# Altium schematic sheet DDR3L Memory.SchDoc
size A4
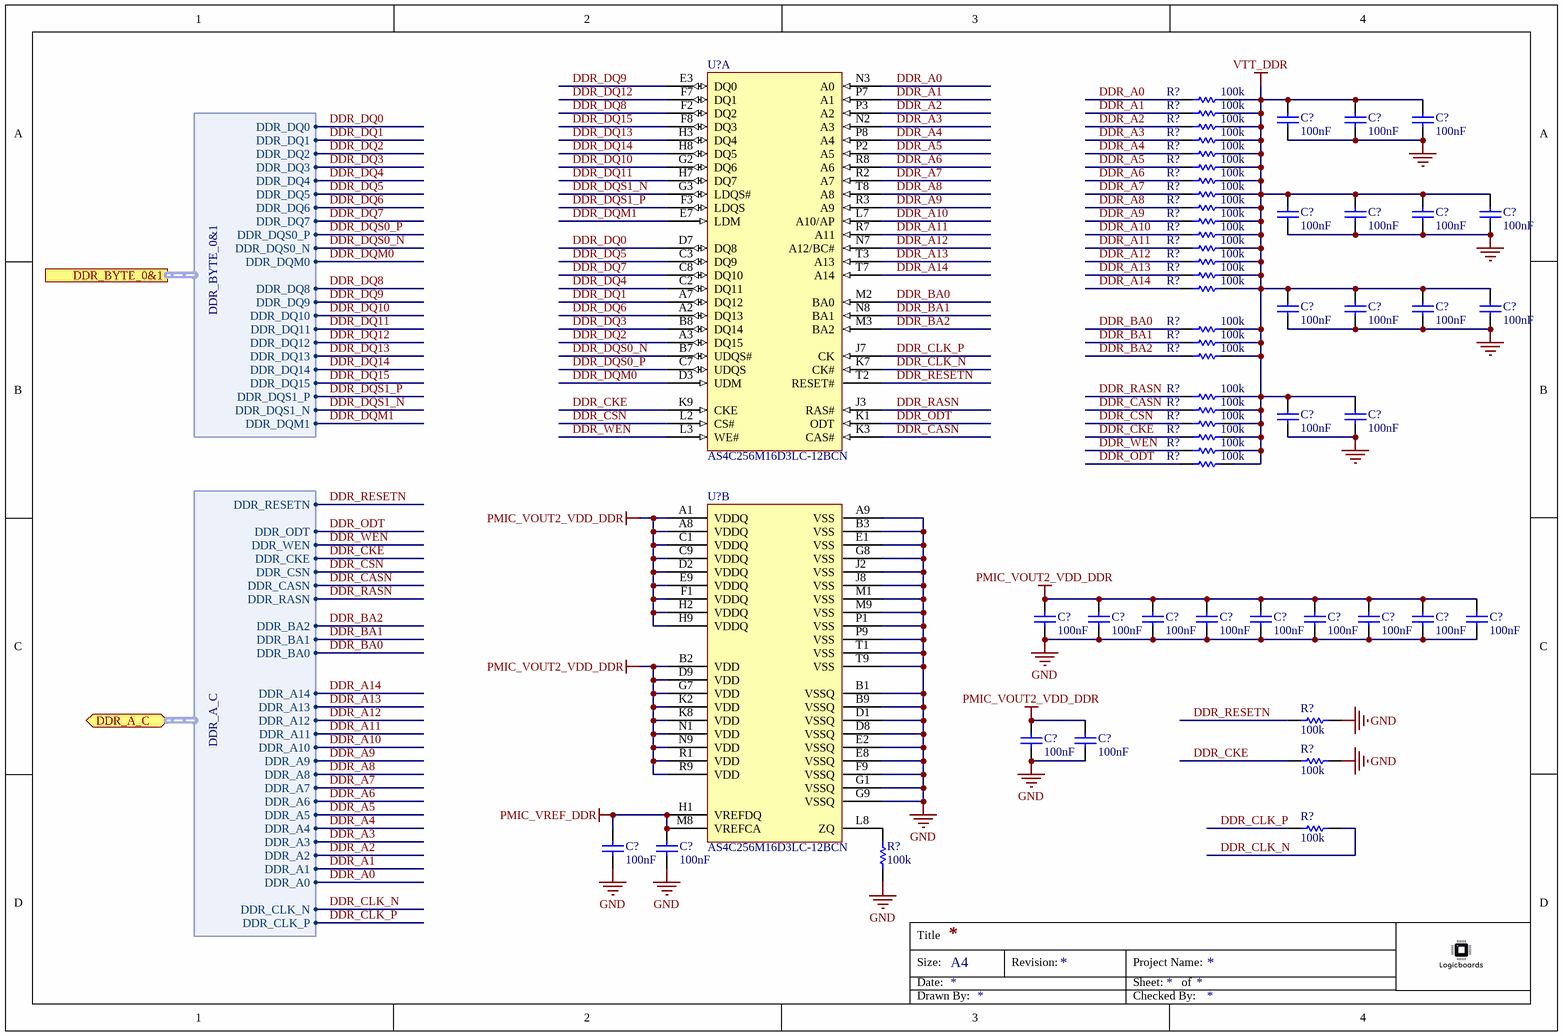
[diagram p0: DDR3L Memory.SchDoc]

## Parts
(Parts that share a designator on the sheet are numbered #1, #2 ... from top to bottom, then left to right.)
C?#1  100nF
C?#2  100nF
C?#3  100nF
C?#4  100nF
C?#5  100nF
C?#6  100nF
C?#7  100nF
C?#8  100nF
C?#9  100nF
C?#10  100nF
C?#11  100nF
C?#12  100nF
C?#13  100nF
C?#14  100nF
C?#15  100nF
C?#16  100nF
C?#17  100nF
C?#18  100nF
C?#19  100nF
C?#20  100nF
C?#21  100nF
C?#22  100nF
C?#23  100nF
C?#24  100nF
C?#25  100nF
C?#26  100nF
R?#1  100k
R?#2  100k
R?#3  100k
R?#4  100k
R?#5  100k
R?#6  100k
R?#7  100k
R?#8  100k
R?#9  100k
R?#10  100k
R?#11  100k
R?#12  100k
R?#13  100k
R?#14  100k
R?#15  100k
R?#16  100k
R?#17  100k
R?#18  100k
R?#19  100k
R?#20  100k
R?#21  100k
R?#22  100k
R?#23  100k
R?#24  100k
R?#25  100k
R?#26  100k
R?#27  100k
R?#28  100k
U?#1  AS4C256M16D3LC-12BCN  (part A of 2)
U?#2  AS4C256M16D3LC-12BCN  (part B of 2)

## Ports
DDR_A_C (bidir, harness DDR_A_C), DDR_BYTE_0&1 (harness DDR_BYTE_0&1)

## Harnesses
DDR_BYTE_0&1: DDR_DQ0, DDR_DQ1, DDR_DQ2, DDR_DQ3, DDR_DQ4, DDR_DQ5, DDR_DQ6, DDR_DQ7, DDR_DQS0_P, DDR_DQS0_N, DDR_DQM0, DDR_DQ8, DDR_DQ9, DDR_DQ10, DDR_DQ11, DDR_DQ12, DDR_DQ13, DDR_DQ14, DDR_DQ15, DDR_DQS1_P, DDR_DQS1_N, DDR_DQM1
DDR_A_C: DDR_CLK_P, DDR_CLK_N, DDR_A0, DDR_A1, DDR_A2, DDR_A3, DDR_A4, DDR_A5, DDR_A6, DDR_A7, DDR_A8, DDR_A9, DDR_A10, DDR_A11, DDR_A12, DDR_A13, DDR_A14, DDR_BA0, DDR_BA1, DDR_BA2, DDR_RASN, DDR_CASN, DDR_CSN, DDR_CKE, DDR_WEN, DDR_ODT, DDR_RESETN

## Nets
GND: C?#1.2 C?#2.2 C?#3.2 C?#4.2 C?#5.2 C?#6.2 C?#7.2 C?#8.2 C?#9.2 C?#10.2 C?#11.2 C?#12.2 C?#13.2 C?#14.2 C?#15.2 C?#16.2 C?#17.2 C?#18.2 C?#19.2 C?#20.2 C?#21.2 C?#22.2 C?#23.2 C?#24.2 C?#25.2 C?#26.2 R?#25.2 R?#26.2 R?#28.1 U?#2.A9(VSS) U?#2.B1(VSSQ) U?#2.B3(VSS) U?#2.B9(VSSQ) U?#2.D1(VSSQ) U?#2.D8(VSSQ) U?#2.E1(VSS) U?#2.E2(VSSQ) U?#2.E8(VSSQ) U?#2.F9(VSSQ) U?#2.G1(VSSQ) U?#2.G8(VSS) U?#2.G9(VSSQ) U?#2.J2(VSS) U?#2.J8(VSS) U?#2.M1(VSS) U?#2.M9(VSS) U?#2.P1(VSS) U?#2.P9(VSS) U?#2.T1(VSS) U?#2.T9(VSS)
PMIC_VOUT2_VDD_DDR: C?#14.1 C?#15.1 C?#16.1 C?#17.1 C?#18.1 C?#19.1 C?#20.1 C?#21.1 C?#22.1 C?#23.1 C?#24.1 U?#2.A1(VDDQ) U?#2.A8(VDDQ) U?#2.B2(VDD) U?#2.C1(VDDQ) U?#2.C9(VDDQ) U?#2.D2(VDDQ) U?#2.D9(VDD) U?#2.E9(VDDQ) U?#2.F1(VDDQ) U?#2.G7(VDD) U?#2.H2(VDDQ) U?#2.H9(VDDQ) U?#2.K2(VDD) U?#2.K8(VDD) U?#2.N1(VDD) U?#2.N9(VDD) U?#2.R1(VDD) U?#2.R9(VDD)
PMIC_VREF_DDR: C?#25.1 C?#26.1 U?#2.H1(VREFDQ) U?#2.M8(VREFCA)
VTT_DDR: C?#1.1 C?#2.1 C?#3.1 C?#4.1 C?#5.1 C?#6.1 C?#7.1 C?#8.1 C?#9.1 C?#10.1 C?#11.1 C?#12.1 C?#13.1 R?#1.2 R?#2.2 R?#3.2 R?#4.2 R?#5.2 R?#6.2 R?#7.2 R?#8.2 R?#9.2 R?#10.2 R?#11.2 R?#12.2 R?#13.2 R?#14.2 R?#15.2 R?#16.2 R?#17.2 R?#18.2 R?#19.2 R?#20.2 R?#21.2 R?#22.2 R?#23.2 R?#24.2
DDR_A0: R?#1.1 U?#1.N3(A0) ; port DDR_A_C.DDR_A0
DDR_A1: R?#2.1 U?#1.P7(A1) ; port DDR_A_C.DDR_A1
DDR_A2: R?#3.1 U?#1.P3(A2) ; port DDR_A_C.DDR_A2
DDR_A3: R?#4.1 U?#1.N2(A3) ; port DDR_A_C.DDR_A3
DDR_A4: R?#5.1 U?#1.P8(A4) ; port DDR_A_C.DDR_A4
DDR_A5: R?#6.1 U?#1.P2(A5) ; port DDR_A_C.DDR_A5
DDR_A6: R?#7.1 U?#1.R8(A6) ; port DDR_A_C.DDR_A6
DDR_A7: R?#8.1 U?#1.R2(A7) ; port DDR_A_C.DDR_A7
DDR_A8: R?#9.1 U?#1.T8(A8) ; port DDR_A_C.DDR_A8
DDR_A9: R?#10.1 U?#1.R3(A9) ; port DDR_A_C.DDR_A9
DDR_A10: R?#11.1 U?#1.L7(A10/AP) ; port DDR_A_C.DDR_A10
DDR_A11: R?#12.1 U?#1.R7(A11) ; port DDR_A_C.DDR_A11
DDR_A12: R?#13.1 U?#1.N7(A12/BC#) ; port DDR_A_C.DDR_A12
DDR_A13: R?#14.1 U?#1.T3(A13) ; port DDR_A_C.DDR_A13
DDR_A14: R?#15.1 U?#1.T7(A14) ; port DDR_A_C.DDR_A14
DDR_BA0: R?#16.1 U?#1.M2(BA0) ; port DDR_A_C.DDR_BA0
DDR_BA1: R?#17.1 U?#1.N8(BA1) ; port DDR_A_C.DDR_BA1
DDR_BA2: R?#18.1 U?#1.M3(BA2) ; port DDR_A_C.DDR_BA2
DDR_CASN: R?#20.1 U?#1.K3(CAS#) ; port DDR_A_C.DDR_CASN
DDR_CKE: R?#22.1 R?#26.1 U?#1.K9(CKE) ; port DDR_A_C.DDR_CKE
DDR_CLK_N: R?#27.2 U?#1.K7(CK#) ; port DDR_A_C.DDR_CLK_N
DDR_CLK_P: R?#27.1 U?#1.J7(CK) ; port DDR_A_C.DDR_CLK_P
DDR_CSN: R?#21.1 U?#1.L2(CS#) ; port DDR_A_C.DDR_CSN
DDR_DQ0: U?#1.D7(DQ8) ; port DDR_BYTE_0&1.DDR_DQ0
DDR_DQ1: U?#1.A7(DQ12) ; port DDR_BYTE_0&1.DDR_DQ1
DDR_DQ2: U?#1.A3(DQ15) ; port DDR_BYTE_0&1.DDR_DQ2
DDR_DQ3: U?#1.B8(DQ14) ; port DDR_BYTE_0&1.DDR_DQ3
DDR_DQ4: U?#1.C2(DQ11) ; port DDR_BYTE_0&1.DDR_DQ4
DDR_DQ5: U?#1.C3(DQ9) ; port DDR_BYTE_0&1.DDR_DQ5
DDR_DQ6: U?#1.A2(DQ13) ; port DDR_BYTE_0&1.DDR_DQ6
DDR_DQ7: U?#1.C8(DQ10) ; port DDR_BYTE_0&1.DDR_DQ7
DDR_DQ8: U?#1.F2(DQ2) ; port DDR_BYTE_0&1.DDR_DQ8
DDR_DQ9: U?#1.E3(DQ0) ; port DDR_BYTE_0&1.DDR_DQ9
DDR_DQ10: U?#1.G2(DQ6) ; port DDR_BYTE_0&1.DDR_DQ10
DDR_DQ11: U?#1.H7(DQ7) ; port DDR_BYTE_0&1.DDR_DQ11
DDR_DQ12: U?#1.F7(DQ1) ; port DDR_BYTE_0&1.DDR_DQ12
DDR_DQ13: U?#1.H3(DQ4) ; port DDR_BYTE_0&1.DDR_DQ13
DDR_DQ14: U?#1.H8(DQ5) ; port DDR_BYTE_0&1.DDR_DQ14
DDR_DQ15: U?#1.F8(DQ3) ; port DDR_BYTE_0&1.DDR_DQ15
DDR_DQM0: U?#1.D3(UDM) ; port DDR_BYTE_0&1.DDR_DQM0
DDR_DQM1: U?#1.E7(LDM) ; port DDR_BYTE_0&1.DDR_DQM1
DDR_DQS0_N: U?#1.B7(UDQS#) ; port DDR_BYTE_0&1.DDR_DQS0_N
DDR_DQS0_P: U?#1.C7(UDQS) ; port DDR_BYTE_0&1.DDR_DQS0_P
DDR_DQS1_N: U?#1.G3(LDQS#) ; port DDR_BYTE_0&1.DDR_DQS1_N
DDR_DQS1_P: U?#1.F3(LDQS) ; port DDR_BYTE_0&1.DDR_DQS1_P
DDR_ODT: R?#24.1 U?#1.K1(ODT) ; port DDR_A_C.DDR_ODT
DDR_RASN: R?#19.1 U?#1.J3(RAS#) ; port DDR_A_C.DDR_RASN
DDR_RESETN: R?#25.1 U?#1.T2(RESET#) ; port DDR_A_C.DDR_RESETN
DDR_WEN: R?#23.1 U?#1.L3(WE#) ; port DDR_A_C.DDR_WEN
NetR?#28_2: R?#28.2 U?#2.L8(ZQ)

Not connected (* = marked no-connect by the designer): U?#2 J1(NC1) J9(NC2) L1(NC3) L9(NC4) M7(NC5)

## Notes on the sheet
- Title
- Size:
- Date:
- A4
- Revision:
- Sheet:
- Project Name:
- of
- Drawn By:
- Checked By:

## Library data of the parts
C?#1-C?#26 = CAP_SMD: Capacitor MLCC; Tolerance: 10%; Dielectric: X5R; Voltage Rating: 6.3V; Supplier 1: Mouser; Manufacturer 1: *; Manufacturer Part Number 1: *; RoHS: Yes; Mount: Surface Mount; Package: *; Capacitance: *; Length: *; Lead Free: Lead Free; Supplier Part Number 1: *; Supplier 2: Digikey; Supplier Part Number 2: *; Value: 100nF
R?#1-R?#28 = RES_SMD: General Purpose Chip Resistor Thick Film; Supplier 1: Mouser; RoHS: Yes; Category: Resistors; RoHS Compliant: Yes; Resistance: *; Supplier 2: Digikey; Supplier Part Number 2: *; Package: *; Value: 100k
U?#1 U?#2 = AS4C256M16D3LC-12BCN: IC DDR3L 4Gb Memory; Manufacturer 1: Alliance Memory; Manufacturer Part Number 1: AS4C256M16D3-12BCN; Address Bus Width: 15b; Access Time: 20ns; Memory Type: RAM,DDR3 SDRAM; Frequency: 800MHz; Interface: Parallel; Operating Supply Voltage: 1.5V; Supplier 1: Mouser; RoHS: Yes; Category: Memory; Case/Package: TFBGA; Number of Pins: 96; Min Operating Temperature: 0°C; Max Operating Temperature: 95°C; Packaging: Tray; Density: 4Gb; Max Frequency: 800MHz; Lead Free: Lead Free; RoHS Compliant: Yes; ComponentLink1URL: https://datasheet.ciiva.com/48497/4gb-as4c256m16d3-48497159.pdf?src-supplier=Avnet; ComponentLink1Description: https://datasheet.ciiva.com/48497/4gb-as4c256m16d3-48497159.pdf?src-supplier=Avnet; Supplier Part Number 1: 913-A4C256M16D312BCN; Datasheet: https://www.mouser.in/datasheet/2/12/AllianceMemory_4G_DDR3L_AS4C256M16D3LC_March2020_R-1826861.pdf; Supplier 2: Digikey; Supplier Part Number 2: *